# Altium schematic sheet B1029_T01_V1.1.SchDoc
size A2
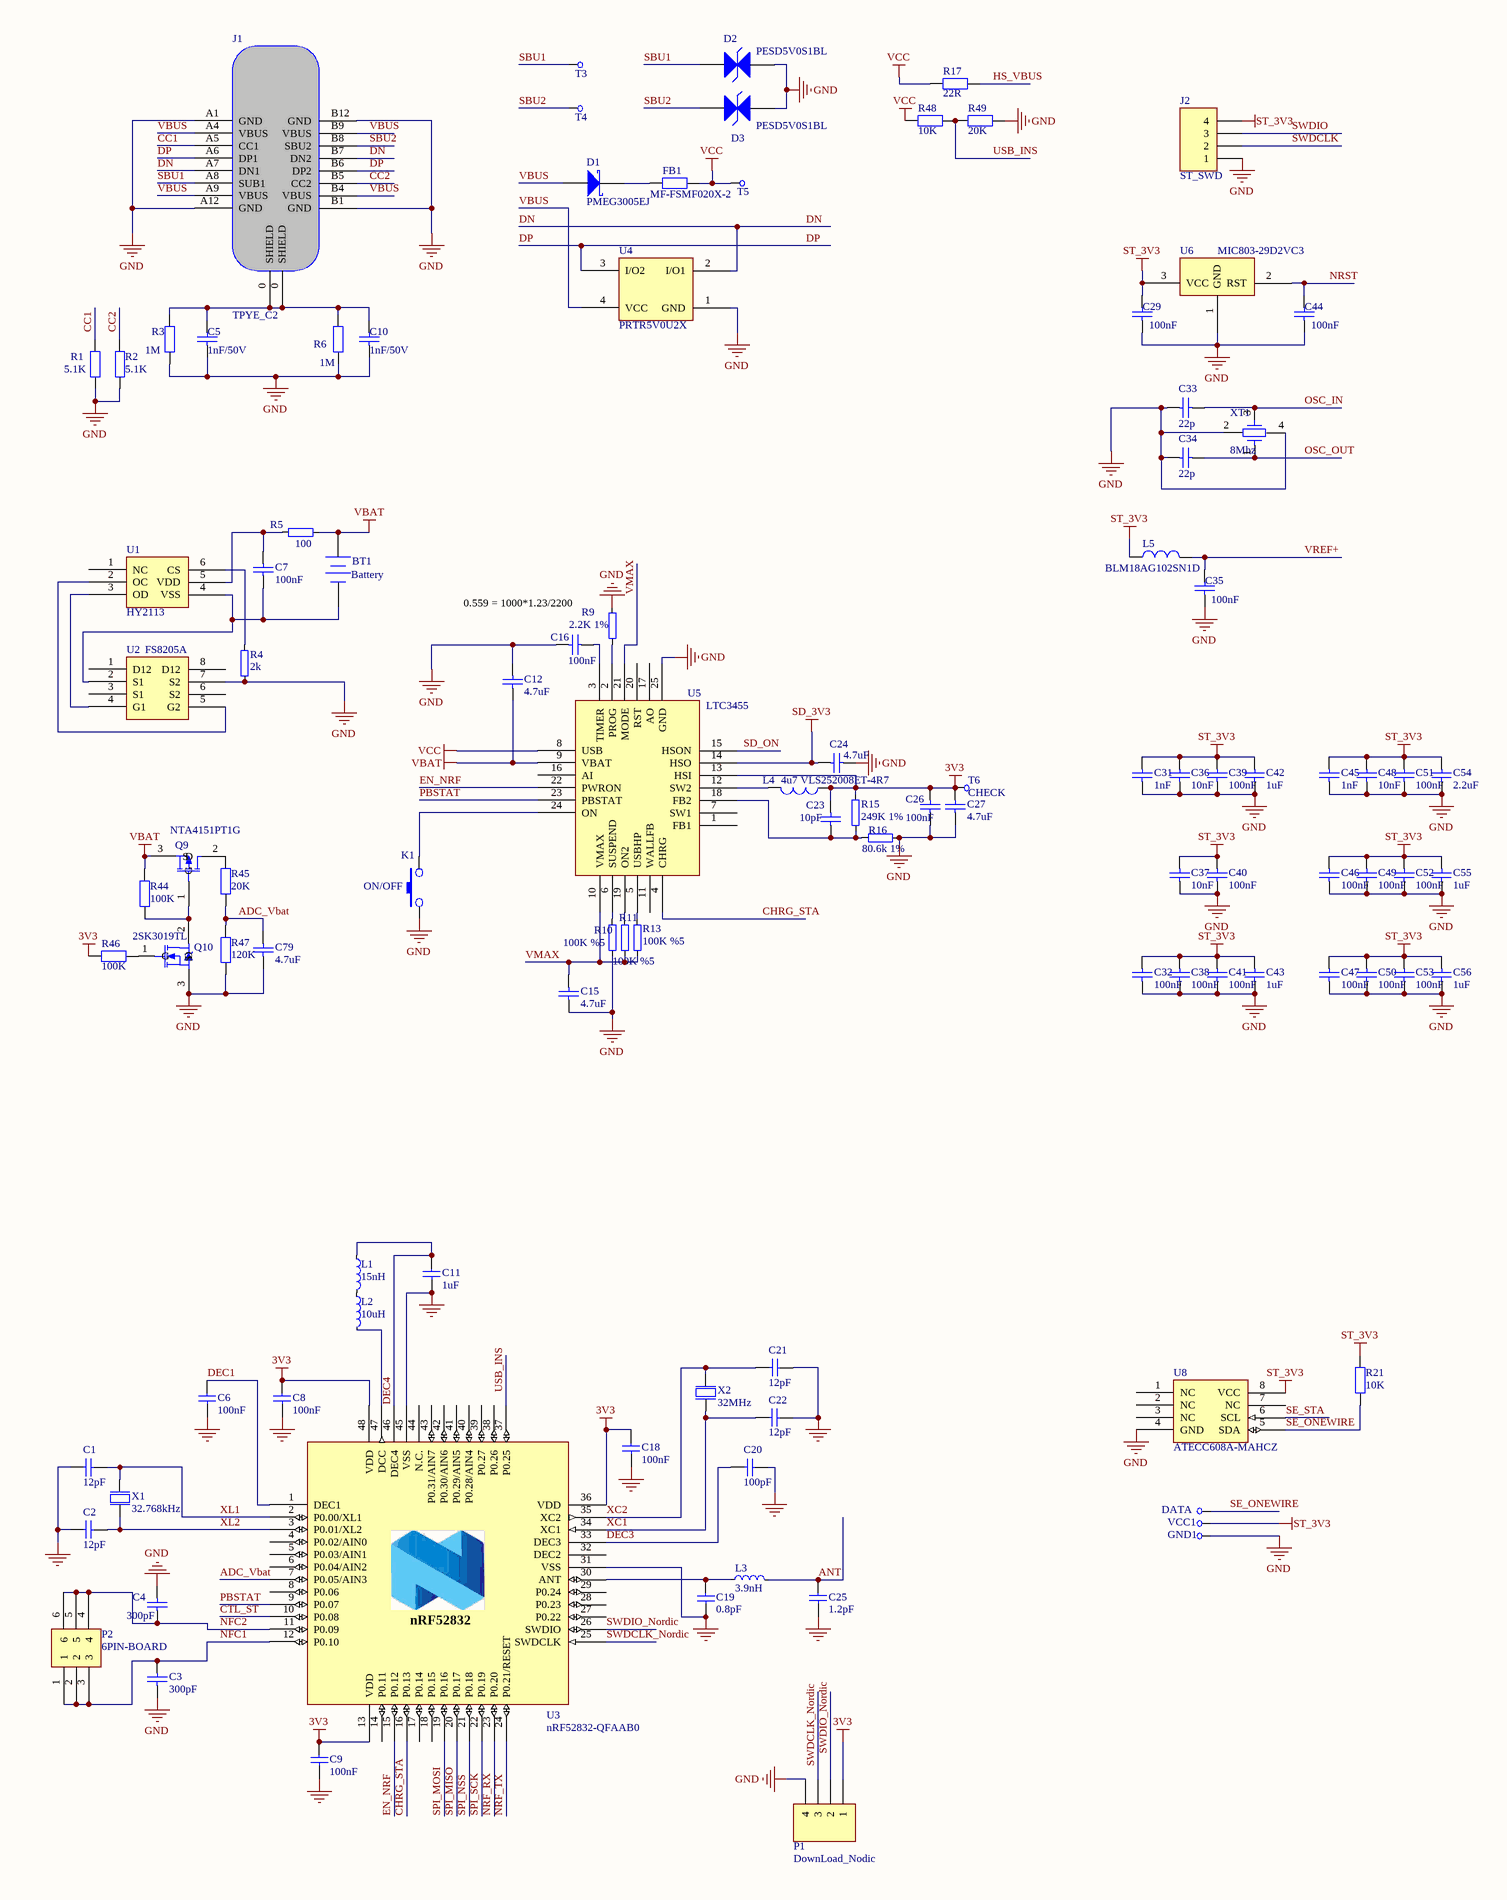
[diagram p0: B1029_T01_V1.1.SchDoc, left]
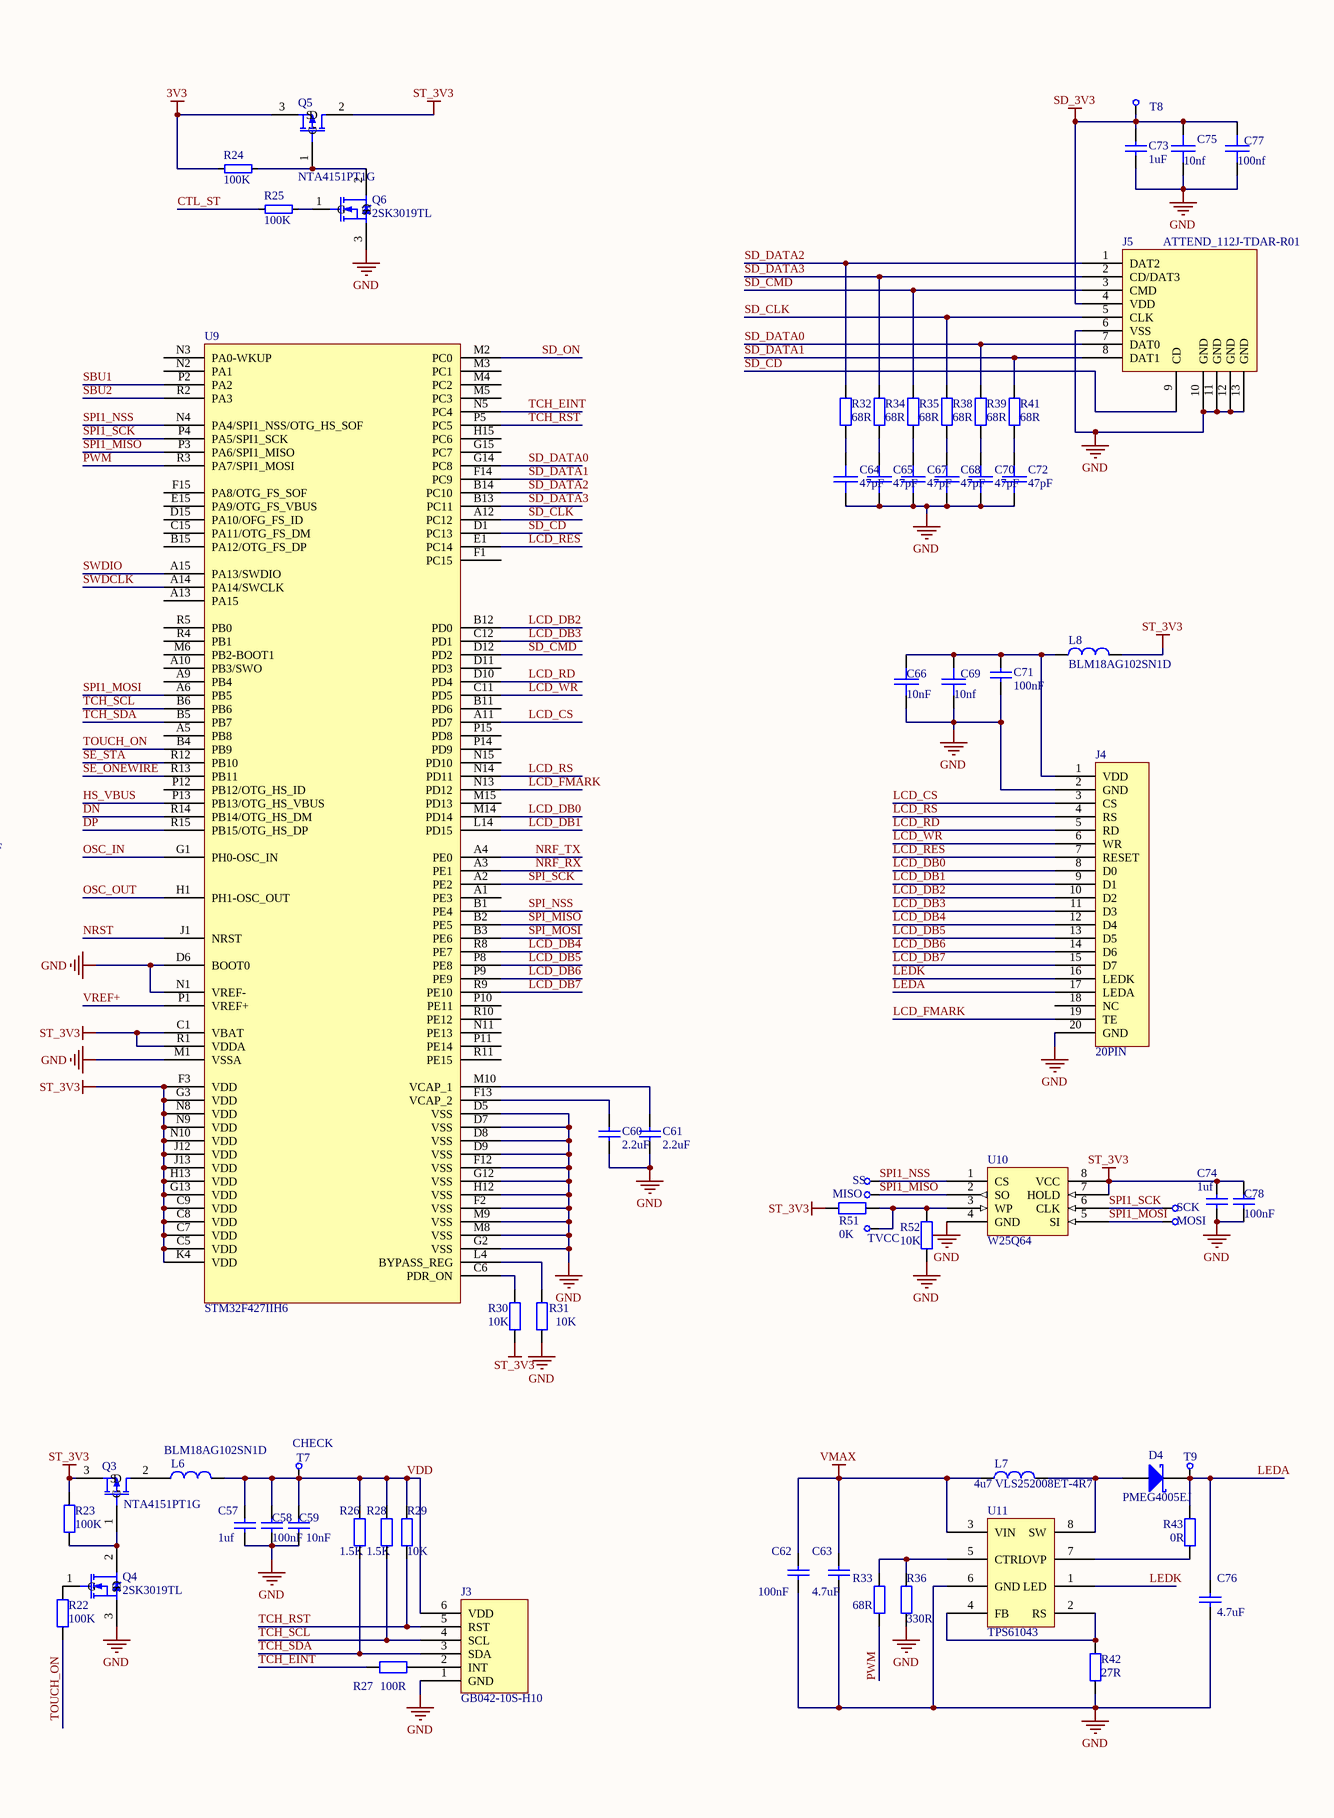
[diagram p1: B1029_T01_V1.1.SchDoc, right]

## Parts
BT1  Battery  [BAT_CON]
C1  12pF  [0402-c]
C2  12pF  [0402-c]
C3  300pF  [0402-C]
C4  300pF  [0402-C]
C5  1nF/50V  [0402-c]
C6  100nF  [0402-c]
C7  100nF  [0402-c]
C8  100nF  [0402-c]
C9  100nF  [0402-c]
C10  1nF/50V  [0402-c]
C11  1uF  [0402-c]
C12  4.7uF  [0402-c]
C15  4.7uF  [0402-c]
C16  100nF  [0402-c]
C18  100nF  [0402-c]
C19  0.8pF  [0402-c]
C20  100pF  [0402-c]
C21  12pF  [0402-c]
C22  12pF  [0402-c]
C23  10pF  [0402-c]
C24  4.7uF  [0402-c]
C25  1.2pF  [0402-c]
C26  100nF  [0402-C]
C27  4.7uF  [0402-c]
C29  100nF  [0402-c]
C31  1nF  [0402-c]
C32  100nF  [0402-c]
C33  value 22p  [0402-c]  (hidden comment: 20p)
C34  value 22p  [0402-C]  (hidden comment: 20p)
C35  100nF  [0402-c]
C36  10nF  [0402-c]
C37  10nF  [0402-c]
C38  100nF  [0402-c]
C39  100nF  [0402-c]
C40  100nF  [0402-c]
C41  100nF  [0402-c]
C42  1uF  [0402-c]
C43  1uF  [0402-c]
C44  100nF  [0402-c]
C45  1nF  [0402-c]
C46  100nF  [0402-c]
C47  100nF  [0402-c]
C48  10nF  [0402-c]
C49  100nF  [0402-c]
C50  100nF  [0402-c]
C51  100nF  [0402-c]
C52  100nF  [0402-c]
C53  100nF  [0402-c]
C54  2.2uF  [0402-c]
C55  1uF  [0402-c]
C56  1uF  [0402-c]
C57  1uf  [0402-c]
C58  100nF  [0402-c]
C59  10nF  [0402-c]
C60  2.2uF  [0402-c]
C61  2.2uF  [0402-c]
C62  100nF  [0402-c]
C63  4.7uF  [0402-c]
C64  47pF  [0402-c]
C65  47pF  [0402-c]
C66  10nF  [0402-C]
C67  47pF  [0402-C]
C68  47pF  [0402-c]
C69  10nf  [0402-c]
C70  47pF  [0402-C]
C71  100nF  [0402-c]
C72  47pF  [0402-C]
C73  1uF  [0402-c]
C74  1uf  [0402-c]
C75  10nf  [0402-c]
C76  4.7uF  [0402-c]
C77  100nf  [0402-c]
C78  100nF  [0402-c]
C79  4.7uF  [0402-c]
D1  PMEG3005EJ  [SOD323]
D2  PESD5V0S1BL  [SOD882]
D3  PESD5V0S1BL  [SOD882]
D4  PMEG4005EJ  [SOD323]
DATA  CHECK  [TEST_P]  (value not drawn)
FB1  MF-FSMF020X-2  [0603-1]
GND1  CHECK  [TEST_P]  (value not drawn)
J1  TPYE_C2  [TYPEC2]
J2  ST_SWD  [SWD_CON]
J3  GB042-10S-H10  [6PIN-1]
J4  20PIN  [20PIN-2]
J5  ATTEND_112J-TDAR-R01  [TF_1]
K1  ON/OFF  [switch_con1]
L1  15nH  [INDC1005X04L]
L2  10uH  [0603-1]
L3  3.9nH  [INDC1005X04L]
L4  4u7 VLS252008ET-4R7  [L_2.5X2.0]
L5  BLM18AG102SN1D  [0603-1]
L6  BLM18AG102SN1D  [0603-1]
L7  4u7 VLS252008ET-4R7  [L_2.5X2.0]
L8  BLM18AG102SN1D  [0603-1]
MISO  CHECK  [TEST_P]  (value not drawn)
MOSI  CHECK  [TEST_P]  (value not drawn)
P1  DownLoad_Nodic  [SWD_CON]
P2  6PIN-BOARD  [6PIN-DB]
Q3  NTA4151PT1G  [SOT523_MOSFET]
Q4  2SK3019TL  [SOT523_MOSFET]
Q5  NTA4151PT1G  [SOT523_MOSFET]
Q6  2SK3019TL  [SOT523_MOSFET]
Q9  NTA4151PT1G  [SOT523_MOSFET]
Q10  2SK3019TL  [SOT523_MOSFET]
R1  5.1K  [0402-a]
R2  5.1K  [0402-a]
R3  1M  [0402-a]
R4  2k  [0402-A]
R5  100  [0402-A]
R6  1M  [0402-a]
R9  2.2K 1%  [0402-A]
R10  100K %5  [0402-A]
R11  100K %5  [0402-A]
R13  100K %5  [0402-A]
R15  249K 1%  [0402-A]
R16  80.6k 1%  [0402-A]
R17  22R  [0402-a]
R21  10K  [0402-A]
R22  100K  [0402-A]
R23  100K  [0402-A]
R24  100K  [0402-A]
R25  100K  [0402-A]
R26  1.5K  [0402-A]
R27  100R  [0402-A]
R28  1.5K  [0402-A]
R29  10K  [0402-A]
R30  10K  [0402-A]
R31  10K  [0402-A]
R32  68R  [0402-A]
R33  68R  [0402-a]
R34  68R  [0402-A]
R35  68R  [0402-A]
R36  330R  [0402-a]
R38  68R  [0402-A]
R39  68R  [0402-A]
R41  68R  [0402-A]
R42  27R  [0402-a]
R43  0R  [0402-a]
R44  100K  [0402-A]
R45  20K  [0402-A]
R46  100K  [0402-A]
R47  120K  [0402-A]
R48  10K  [0402-A]
R49  20K  [0402-A]
R51  0K  [0402-A]
R52  10K  [0402-A]
SCK  CHECK  [TEST_P]  (value not drawn)
SS  CHECK  [TEST_P]  (value not drawn)
T3  CHECK  [TEST_P]  (value not drawn)
T4  CHECK  [TEST_P]  (value not drawn)
T5  CHECK  [TEST_P]  (value not drawn)
T6  CHECK  [TEST_P]
T7  CHECK  [TEST_P]
T8  CHECK  [TEST_P]  (value not drawn)
T9  CHECK  [TEST_P]  (value not drawn)
TVCC  CHECK  [TEST_P]  (value not drawn)
U1  HY2113  [DFN-6L]
U2  FS8205A  [TSSOP-8]
U3  nRF52832-QFAAB0  [2-QFN40P600X600X90-48N]
U4  PRTR5V0U2X  [SOT143B]
U5  LTC3455  [QFN-24]
U6  MIC803-29D2VC3  [SC70-3]
U8  ATECC608A-MAHCZ  [DFN8-SE]
U9  STM32F427IIH6  [UFBGA176+25]
U10  W25Q64  [WSON-8]
U11  TPS61043  [QFN-8]
VCC1  CHECK  [TEST_P]  (value not drawn)
X1  32.768kHz  [XTAL_3215]
X2  32MHz  [BT-XTAL_2016]
XT1  8Mhz  [OSC_4-3225]

## Nets
3V3: C8.2 C9.2 C18.2 C23.1 C26.2 C27.1 L4.1 P1.1 Q5.3(S) R15.1 R24.2 R46.2 T6.1 U3.13(VDD) U3.36(VDD) U3.48(VDD) U5.13(HSI)
GND: C1.1 C2.1 C3.1 C4.1 C5.1 C6.1 C8.1 C9.1 C10.1 C11.1 C12.2 C15.1 C16.1 C18.1 C19.2 C20.1 C21.1 C22.2 C24.1 C25.1 C26.1 C27.2 C29.1 C31.2 C32.2 C33.2 C34.2 C35.1 C36.2 C37.2 C38.2 C39.2 C40.2 C41.2 C42.2 C43.2 C44.1 C45.2 C46.2 C47.2 C48.2 C49.2 C50.2 C51.2 C52.2 C53.2 C54.2 C55.2 C56.2 C57.1 C58.1 C59.1 C60.2 C61.2 C62.1 C63.1 C64.1 C65.1 C66.2 C67.1 C68.1 C69.2 C70.1 C71.2 C72.1 C73.2 C74.1 C75.2 C76.1 C77.2 C78.1 C79.2 D2.1(A) D3.1(A) GND1.1 J1.A1(GND) J1.A12(GND) J1.B1(GND) J1.B12(GND) J2.1 J3.1(GND) J3.7 J3.8 J4.2(GND) J4.20(GND) J4.21 J4.22 J5.6(VSS) J5.10(GND) J5.11(GND) J5.12(GND) J5.13(GND) K1.1 P1.4 P2.0 Q4.3(S) Q6.3(S) Q10.3(S) R1.1 R2.1 R3.1 R4.2 R6.1 R9.1 R10.1 R16.1 R31.1 R36.1 R42.1 R47.1 R49.1 R52.1 U2.7(S2) U3.31(VSS) U3.45(VSS) U3.49(GND) U4.1(GND) U5.25(GND) U6.1(GND) U8.4(GND) U8.9(GND) U9.D5(VSS) U9.D6(BOOT0) U9.D7(VSS) U9.D8(VSS) U9.D9(VSS) U9.F2(VSS) U9.F6(GND) U9.F7(GND) U9.F8(GND) U9.F9(GND) U9.F10(GND) U9.F12(VSS) U9.G2(VSS) U9.G6(GND) U9.G7(GND) U9.G8(GND) U9.G9(GND) U9.G10(GND) U9.G12(VSS) U9.H6(GND) U9.H7(GND) U9.H8(GND) U9.H9(GND) U9.H10(GND) U9.H12(VSS) U9.J6(GND) U9.J7(GND) U9.J8(GND) U9.J9(GND) U9.J10(GND) U9.K6(GND) U9.K7(GND) U9.K8(GND) U9.K9(GND) U9.K10(GND) U9.M1(VSSA) U9.M8(VSS) U9.M9(VSS) U9.N1(VREF-) U10.4(GND) U10.9(GND) U11.6(GND) U11.9(GND) X2.2(GND) X2.4(GND) XT1.2 XT1.4
SD_3V3: C24.2 C73.1 C75.1 C77.1 J5.4(VDD) T8.1 U5.14(HSO)
ST_3V3: C29.2 C31.1 C32.1 C36.1 C37.1 C38.1 C39.1 C40.1 C41.1 C42.1 C43.1 C45.1 C46.1 C47.1 C48.1 C49.1 C50.1 C51.1 C52.1 C53.1 C54.1 C55.1 C56.1 C74.2 C78.2 J2.4 L5.1 L8.2 Q3.3(S) Q5.2(D) R21.1 R23.2 R30.1 R51.2 U6.3(VCC) U8.8(VCC) U9.C1(VBAT) U9.C5(VDD) U9.C7(VDD) U9.C8(VDD) U9.C9(VDD) U9.F3(VDD) U9.G3(VDD) U9.G13(VDD) U9.H13(VDD) U9.J12(VDD) U9.J13(VDD) U9.K4(VDD) U9.N8(VDD) U9.N9(VDD) U9.N10(VDD) U9.R1(VDDA) U10.7(HOLD) U10.8(VCC) VCC1.1
VBAT: BT1.1(+) C12.1 Q9.3(S) R5.2 R44.2 U5.9(VBAT)
VCC: FB1.2 R17.1 R48.1 T5.1 U5.8(USB)
VMAX: C15.2 C62.2 C63.2 L7.1 R11.2 R13.1 U5.10(VMAX) U5.21(MODE) U11.3(VIN)
ADC_Vbat: C79.1 R45.1 R47.2 U3.7(P0.05/AIN3)
ANT: C25.2 L3.2
CC1: J1.A5(CC1) R1.2
CC2: J1.B5(CC2) R2.2
CHRG_STA: U3.16(P0.13) U5.4(CHRG)
CTL_ST: R25.2 U3.10(P0.08)
DEC1: C6.2 U3.1(DEC1)
DEC3: C20.2 U3.33(DEC3)
DEC4: C11.2 L1.1 U3.46(DEC4)
DN: J1.A7(DN1) J1.B7(DN2) U4.2(I/O1) U9.R14(PB14/OTG_HS_DM)
DP: J1.A6(DP1) J1.B6(DP2) U4.3(I/O2) U9.R15(PB15/OTG_HS_DP)
EN_NRF: U3.15(P0.12) U5.22(PWRON)
HS_VBUS: R17.2 U9.P13(PB13/OTG_HS_VBUS)
LCD_CS: J4.3(CS) U9.A11(PD7)
LCD_DB0: J4.8(D0) U9.M14(PD14)
LCD_DB1: J4.9(D1) U9.L14(PD15)
LCD_DB2: J4.10(D2) U9.B12(PD0)
LCD_DB3: J4.11(D3) U9.C12(PD1)
LCD_DB4: J4.12(D4) U9.R8(PE7)
LCD_DB5: J4.13(D5) U9.P8(PE8)
LCD_DB6: J4.14(D6) U9.P9(PE9)
LCD_DB7: J4.15(D7) U9.R9(PE10)
LCD_FMARK: J4.19(TE) U9.N13(PD12)
LCD_RD: J4.5(RD) U9.D10(PD4)
LCD_RES: J4.7(RESET) U9.E1(PC14)
LCD_RS: J4.4(RS) U9.N14(PD11)
LCD_WR: J4.6(WR) U9.C11(PD5)
LEDA: C76.2 D4.2(K) J4.17(LEDA) R43.2 T9.1
LEDK: J4.16(LEDK) U11.1(LED)
NFC1: C3.2 P2.1 P2.2 P2.3 U3.12(P0.10)
NFC2: C4.2 P2.4 P2.5 P2.6 U3.11(P0.09)
NRF_RX: U3.23(P0.20) U9.A3(PE1)
NRF_TX: U3.24(P0.21/RESET) U9.A4(PE0)
NRST: C44.2 U6.2(RST) U9.J1(NRST)
OSC_IN: C33.1 U9.G1(PH0-OSC_IN) XT1.3
OSC_OUT: C34.1 U9.H1(PH1-OSC_OUT) XT1.1
PBSTAT: U3.9(P0.07) U5.23(PBSTAT)
PWM: R33.1 U9.R3(PA7/SPI1_MOSI)
SBU1: D2.2(K) J1.A8(SUB1) T3.1 U9.P2(PA2)
SBU2: D3.2(K) J1.B8(SBU2) T4.1 U9.R2(PA3)
SD_CD: J5.9(CD) U9.D1(PC13)
SD_CLK: J5.5(CLK) R38.1 U9.A12(PC12)
SD_CMD: J5.3(CMD) R35.1 U9.D12(PD2)
SD_DATA0: J5.7(DAT0) R39.1 U9.G14(PC8)
SD_DATA1: J5.8(DAT1) R41.1 U9.F14(PC9)
SD_DATA2: J5.1(DAT2) R32.1 U9.B14(PC10)
SD_DATA3: J5.2(CD/DAT3) R34.1 U9.B13(PC11)
SD_ON: U5.15(HSON) U9.M2(PC0)
SE_ONEWIRE: DATA.1 R21.2 U8.5(SDA) U9.R13(PB11)
SE_STA: U8.6(SCL) U9.R12(PB10)
SPI1_MISO: MISO.1 U9.P3(PA6/SPI1_MISO) U10.2(SO)
SPI1_MOSI: MOSI.1 U9.A6(PB5) U10.5(SI)
SPI1_NSS: SS.1 U9.N4(PA4/SPI1_NSS/OTG_HS_SOF) U10.1(CS)
SPI1_SCK: SCK.1 U9.P4(PA5/SPI1_SCK) U10.6(CLK)
SPI_MISO: U3.20(P0.17) U9.B2(PE5)
SPI_MOSI: U3.19(P0.16) U9.B3(PE6)
SPI_NSS: U3.21(P0.18) U9.B1(PE4)
SPI_SCK: U3.22(P0.19) U9.A2(PE2)
SWDCLK: J2.2 U9.A14(PA14/SWCLK)
SWDCLK_Nordic: P1.3 U3.25(SWDCLK)
SWDIO: J2.3 U9.A15(PA13/SWDIO)
SWDIO_Nordic: P1.2 U3.26(SWDIO)
TCH_EINT: R27.2 U9.N5(PC4)
TCH_RST: J3.5(RST) R29.1 U9.P5(PC5)
TCH_SCL: J3.4(SCL) R28.1 U9.B6(PB6)
TCH_SDA: J3.3(SDA) R26.1 U9.B5(PB7)
TOUCH_ON: R22.1 U9.B4(PB9)
USB_INS: R48.2 R49.2 U3.37(P0.25)
VBUS: D1.1(A) J1.A4(VBUS) J1.A9(VBUS) J1.B4(VBUS) J1.B9(VBUS) U4.4(VCC)
VDD: C57.2 C58.2 C59.2 J3.6(VDD) L6.2 R26.2 R28.2 R29.2 T7.1
VREF+: C35.2 L5.2 U9.P1(VREF+)
XC1: C22.1 U3.34(XC1) X2.1(inp)
XC2: C21.2 U3.35(XC2) X2.3(out)
XL1: C1.2 U3.2(P0.00/XL1) X1.1(inp)
XL2: C2.2 U3.3(P0.01/XL2) X1.2(out)
NetBT1_2: BT1.2(-) C7.1 U1.4(VSS) U2.2(S1)
NetC5_2: C5.2 C10.2 J1.0(SHIELD) R3.2 R6.2
NetC7_2: C7.2 R5.1 U1.5(VDD)
NetC16_2: C16.2 U5.3(TIMER)
NetC19_1: C19.1 L3.1 U3.30(ANT)
NetC23_2: C23.2 R15.2 R16.2 U5.18(FB2)
NetC60_1: C60.1 U9.F13(VCAP_2)
NetC61_1: C61.1 U9.M10(VCAP_1)
NetC64_2: C64.2 R32.2
NetC65_2: C65.2 R34.2
NetC66_1: C66.1 C69.1 C71.1 J4.1(VDD) L8.1
NetC67_2: C67.2 R35.2
NetC68_2: C68.2 R38.2
NetC70_2: C70.2 R39.2
NetC72_2: C72.2 R41.2
NetD1_2: D1.2(K) FB1.1
NetD4_1: D4.1(A) L7.2 U11.8(SW)
NetJ3_2: J3.2(INT) R27.1
NetK1_2: K1.2 U5.24(ON)
NetL1_2: L1.2 L2.1
NetL2_2: L2.2 U3.47(DCC)
NetL4_2: L4.2 U5.12(SW2)
NetL6_1: L6.1 Q3.2(D)
NetQ3_1: Q3.1(G) Q4.2(D) R23.1
NetQ4_1: Q4.1(G) R22.2
NetQ5_1: Q5.1(G) Q6.2(D) R24.1
NetQ6_1: Q6.1(G) R25.1
NetQ9_1: Q9.1(G) Q10.2(D) R44.1
NetQ9_2: Q9.2(D) R45.2
NetQ10_1: Q10.1(G) R46.1
NetR4_1: R4.1 U1.6(CS)
NetR9_2: R9.2 U5.2(PROG)
NetR10_2: R10.2 U5.6(SUSPEND)
NetR11_1: R11.1 U5.19(ON2)
NetR13_2: R13.2 U5.5(USBHP)
NetR30_2: R30.2 U9.C6(PDR_ON)
NetR31_2: R31.2 U9.L4(BYPASS_REG)
NetR33_2: R33.2 R36.2 U11.5(CTRL)
NetR42_2: R42.2 U11.2(RS) U11.4(FB)
NetR43_1: R43.1 U11.7(OVP)
NetR51_1: R51.1 R52.2 TVCC.1 U10.3(WP)
NetU1_2: U1.2(OC) U2.5(G2)
NetU1_3: U1.3(OD) U2.4(G1)

Not connected (* = marked no-connect by the designer): J4 18(NC); U1 1(NC); U2 1(D12) 3(S1) 6(S2) 8(D12); U3 4(P0.02/AIN0) 5(P0.03/AIN1) 6(P0.04/AIN2) 8(P0.06) 14(P0.11) 17(P0.14) 18(P0.15) 27(P0.22) 28(P0.23) 29(P0.24) 32(DEC2) 38(P0.26) 39(P0.27) 40(P0.28/AIN4) 41(P0.29/AIN5) 42(P0.30/AIN6) 43(P0.31/AIN7) 44(N.C.); U5 1(FB1) 7(SW1) 11(WALLFB) 16(AI) 17(AO) 20(RST); U8 1(NC) 2(NC) 3(NC) 7(NC); U9 A1(PE3) A5(PB8) A7(PG14) A8(PG13) A9(PB4) A10(PB3/SWO) A13(PA15) B7(PG15) B8(PG12) B9(PG11) B10(PG10) B11(PD6) B15(PA12/OTG_FS_DP) C2(PI7) C3(PI6) C4(PI5) C10(PG9) C13(PI3) C14(PI2) C15(PA11/OTG_FS_DM) D2(PI8) D3(PI9) D4(PI4) D11(PD3) D13(PH15) D14(PI1) D15(PA10/OFG_FS_ID) E2(PF0) E3(PI10) E4(PI11) E12(PH13) E13(PH14) E14(PI0) E15(PA9/OTG_FS_VBUS) F1(PC15) F4(PH2) F15(PA8/OTG_FS_SOF) G4(PH3) G15(PC7) H2(PF2) H3(PF1) H4(PH4) H14(PG8) H15(PC6) J2(PF3) J3(PF4) J4(PH5) J14(PG7) J15(PG6) K1(PF7) K2(PF6) K3(PF5) K12(PH12) K13(PG5) K14(PG4) K15(PG3) L1(PF10) L2(PF9) L3(PF8) L12(PH11) L13(PH10) L15(PG2) M3(PC1) M4(PC2) M5(PC3) M6(PB2-BOOT1) M7(PG1) M11(PH6) M12(PH8) M13(PH9) M15(PD13) N2(PA1) N3(PA0-WKUP) N6(PF13) N7(PG0) N11(PE13) N12(PH7) N15(PD10) P6(PF12) P7(PF15) P10(PE11) P11(PE14) P12(PB12/OTG_HS_ID) P14(PD9) P15(PD8) R4(PB1) R5(PB0) R6(PF11) R7(PF14) R10(PE12) R11(PE15)

## Notes on the sheet
- 0.559 = 1000*1.23/2200
- (in symbol nRF52832-QFAAB0) nRF52832

## Library data of the parts
BT1 = Battery: 备份电池; Published: 24-Mar-1999; LatestRevisionDate: 17-Jul-2002; LatestRevisionNote: Re-released for DXP Platform.; PackageReference: BAT-2; Publisher: Altium Limited
C1 C2 C21 C22 = C0402-12p: Capacitor, NP0, ?%; Part number IPS: 00000002398; Note: 50V; Artikkelnr Noca: 20029159; Artikkelnr Simpro: N.A.; Part Number: C0402-12p; Manufacturer: *; Manufacturer Part Number: *; Datasheet: *; LatestRevisionDate: 2011-05-11; Pin Count: 2; Publisher: Nordic Semiconductor; Published: 2009-05-08; Value: 12pF; Supplier: *; Supplier part number: *; 2nd source Supplier: *; 2nd source part number: *; Footprint Doc: 0402
C3 C4 = Cap: Capacitor; Published: 8-Jun-2000; LatestRevisionDate: 17-Jul-2002; LatestRevisionNote: Re-released for DXP Platform.; PackageReference: RAD-0.3; Publisher: Altium Limited; Value: 300pF
C5 C7 C10 C12 C15 C16 C23 C24 C27 C29 C31-C63 C71 C73 C74 C76 C78 C79 = Cap: 无极性电容; Published: 8-Jun-2000; LatestRevisionDate: 17-Jul-2002; LatestRevisionNote: Re-released for DXP Platform.; PackageReference: RAD-0.3; Publisher: Altium Limited
  C5 C10: Value: 1nF/50V
  C7 C16 C29 C32 C35 C38-C41 C44 C46 C47 C49-C53 C58 C62 C71 C78: Value: 100nF
  C12 C15 C24 C27 C63 C76 C79: Value: 4.7uF
  C23: Value: 10pF
  C31 C45: Value: 1nF
  C36 C37 C48 C59: Value: 10nF
  C42 C43 C55 C56 C73: Value: 1uF
  C54 C60 C61: Value: 2.2uF
  C57 C74: Value: 1uf
C6 C9 C18 = C0402-100n: Capacitor, X7R, ?0%; Part number IPS: 00000005296; Note: 16V; Artikkelnr Noca: 20039200; Artikkelnr Simpro: N.A.; Part Number: C0402-100n; Manufacturer: *; Manufacturer Part Number: *; Datasheet: *; LatestRevisionDate: 2009-11-23; Pin Count: 2; Publisher: Nordic Semiconductor; Published: 2009-05-08; Value: 100nF; Supplier: *; Supplier part number: *; 2nd source Supplier: *; 2nd source part number: *; Footprint Doc: 0402
C8 = C0603-4?: Capacitor, X5R, ?0%; Part number IPS: 00000003141; Note: 6.3V; Artikkelnr Noca: 20069060; Artikkelnr Simpro: N.A.; Part Number: C0603-4?; Manufacturer: *; Manufacturer Part Number: *; Datasheet: *; LatestRevisionDate: 2009-11-23; Pin Count: 2; Publisher: Nordic Semiconductor; Published: 2009-05-08; Value: 100nF; Supplier: *; Supplier part number: *; 2nd source Supplier: *; 2nd source part number: *; Footprint Doc: 0603
C11 = C0603-1?: Capacitor, X7R, ?0%; Part number IPS: 00000000616; Value: 1.0uF; Note: 16V; Artikkelnr Noca: 20039335; Artikkelnr Simpro: N.A.; Part Number: C0603-1?; Manufacturer: *; Manufacturer Part Number: *; Datasheet: *; LatestRevisionDate: 2013-06-05; Pin Count: 2; Publisher: Nordic Semiconductor; Published: 2009-05-08; Supplier: *; Supplier part number: *; 2nd source Supplier: *; 2nd source part number: *; Footprint Doc: 0603
C19 = C0402-0.8p: Capacitor, NP0, ?%; Note: 50V; Artikkelnr Noca: 20029147; Artikkelnr Simpro: N.A.; Part Number: C0402-0.8p; Manufacturer: *; Manufacturer Part Number: *; Datasheet: *; LatestRevisionDate: 2012-11-21; Pin Count: 2; Publisher: Nordic Semiconductor; Published: 2009-05-08; Value: 0.8pF; Supplier: *; Supplier part number: *; 2nd source Supplier: *; 2nd source part number: *; Footprint Doc: 0402
C20 = C0402-100p: Capacitor, NP0, ?%; Part number IPS: 00000002361; Note: 50V; Artikkelnr Noca: 20029135; Artikkelnr Simpro: N.A.; Part Number: C0402-100p; Manufacturer: *; Manufacturer Part Number: *; Datasheet: *; LatestRevisionDate: 2009-05-08; Pin Count: 2; Publisher: Nordic Semiconductor; Published: 2009-05-08; Value: 100pF; Supplier: *; Supplier part number: *; 2nd source Supplier: *; 2nd source part number: *; Footprint Doc: 0402
C25 = C0402-1.2p: Capacitor, NP0, ?.1pF; Part number IPS: 00000005410; Note: 50V; Artikkelnr Noca: 20029157; Artikkelnr Simpro: N.A.; Part Number: C0402-1.2p; Manufacturer: *; Manufacturer Part Number: *; Datasheet: *; LatestRevisionDate: 2011-05-11; Pin Count: 2; Publisher: Nordic Semiconductor; Published: 2009-05-08; Value: 1.2pF; Supplier: *; Supplier part number: *; 2nd source Supplier: *; 2nd source part number: *; Footprint Doc: 0402
C26 = Cap: 无极性电容; Value: 0.1uF; Published: 8-Jun-2000; LatestRevisionDate: 17-Jul-2002; LatestRevisionNote: Re-released for DXP Platform.; PackageReference: RAD-0.3; Publisher: Altium Limited
C64-C70 C72 C75 C77 = SMT_C_0402: Surface mount capacitor 0402
D1 D4 = D-Schottky: 肖特基二极管; Published: 8-Jun-2000; LatestRevisionDate: 17-Jul-2002; LatestRevisionNote: Re-released for DXP Platform.; PackageReference: SMB; Publisher: Altium Limited; Code_JEDEC: DO-214-AA
  D1: Type: PMEG3005EJ
  D4: Type: PMEG4005EJ
D2 D3 = TVS_DIOCODE: TVS
DATA GND1 MISO MOSI SCK SS T3-T9 TVCC VCC1 = CHECK: 测试点
FB1 R1-R3 R6 R17 R21-R23 R26-R36 R38 R39 R41-R49 R51 R52 = Res1: 贴片电阻; Published: 8-Jun-2000; LatestRevisionDate: 17-Jul-2002; LatestRevisionNote: Re-released for DXP Platform.; PackageReference: AXIAL-0.4; Publisher: Altium Limited
  FB1: Value: MF-FSMF020X-2
  R1 R2: Value: 5.1K
  R3 R6: Value: 1M
  R17: Value: 22R
  R21 R29-R31 R48 R52: Value: 10K
  R22 R23 R44 R46: Value: 100K
  R26 R28: Value: 1.5K
  R27: Value: 100R
  R32-R35 R38 R39 R41: Value: 68R
  R36: Value: 330R
  R42: Value: 27R
  R43: Value: 0R
  R45 R49: Value: 20K
  R47: Value: 120K
  R51: Value: 0K
J1 = TPYE_C2: USB
J2 P1 = Header 4: Header, 4-Pin; LatestRevisionDate: 17-Jul-2002; LatestRevisionNote: Re-released for DXP Platform.; Publisher: Altium Limited
J3 = GB042-10S--H10: Touch
J5 = ATTEND_112J-TDAR-R01: MICRO_SD
K1 = KEY
L1 = L0402-15n: Inductor, 320mA, ?%; Manufacturer: Taiyo Yuden; Manufacturer Part Number: HK100515NJ-T; 2nd source part number: 658-1328; Note: High frequency chip inductor ?0%; Artikkelnr Noca: 33029323; Artikkelnr Simpro: N.A.; Part Number: L0402-15n; LatestRevisionDate: 2012-09-19; Pin Count: 2; Publisher: Nordic Semiconductor; Published: 2010-07-12; Value: 15nH; Supplier: Digi-Key; Datasheet: http://www.yuden.co.jp/productdata/catalog/en/mlci04_e.pdf; Supplier part number: 587-1521-1-ND; 2nd source Supplier: Farnell; Footprint Doc: 0402; ComponentLink1Description: Datasheet; ComponentLink2Description: Supplier link
L2 = L0603-10?: Inductor, 80mA, ?0%; Manufacturer: Taiyo Yuden; Manufacturer Part Number: LBMF1608T100K; 2nd source part number: 178-6105; Note: LBMF1608T100K 10µH 80mA 0603; Artikkelnr Noca: 33029314; Artikkelnr Simpro: N.A.; Part Number: L0603-10?; Datasheet: http://www.yuden.co.jp/ut/product/pdf/elb2_e.pdf; LatestRevisionDate: 2012-09-19; Pin Count: 2; Publisher: Nordic Semiconductor; Published: 2010-02-24; Value: 10uH; Supplier: Digi-Key; Supplier part number: 587-1714-1-ND; 2nd source Supplier: Farnell; Footprint Doc: 0603; ComponentLink1Description: Datasheet; ComponentLink2Description: Supplier link
L3 = L0402-3n9: Inductor, 170mA, ?.1nH; Manufacturer: Murata; Manufacturer Part Number: LQP15MN3N9B02D; Note: High frequency chip inductor ?%; Artikkelnr Noca: 33029151; Artikkelnr Simpro: N.A.; Part Number: L0402-3n9; Datasheet: http://search.murata.co.jp/Ceramy/image/img/PDF/ENG/L0075S0084LQP15M.pdf; LatestRevisionDate: 2012-09-19; Pin Count: 2; Publisher: Nordic Semiconductor; Published: 2009-05-08; Value: 3.9nH; Supplier: Digi-Key; Supplier part number: 490-1131-1-ND; 2nd source Supplier: *; 2nd source part number: *; Footprint Doc: 0402; ComponentLink1Description: Datasheet; ComponentLink2Description: Supplier link
L4-L8 = Inductor: 电感; Code_IEC: 1005; Published: 8-Jun-2000; LatestRevisionDate: 17-Jul-2002; LatestRevisionNote: Re-released for DXP Platform.; PackageReference: 0402-A; Publisher: Altium Limited; Code_JEITA: 0402
  L4 L7: Value: 4u7 VLS252008ET-4R7
  L5 L6 L8: Value: BLM18AG102SN1D
Q3 Q5 Q9 = MOSFET-P: P-Channel MOSFET; PackageDocument: 1995/1996; Published: 8-Jun-2000; LatestRevisionDate: 17-Jul-2002; LatestRevisionNote: Re-released for DXP Platform.; PackageReference: E3; Publisher: Altium Limited
Q4 Q6 Q10 = MOSFET-N: N-Channel MOSFET; PackageDocument: 1995/1996; Published: 8-Jun-2000; LatestRevisionDate: 17-Jul-2002; LatestRevisionNote: Re-released for DXP Platform.; PackageReference: E3; Publisher: Altium Limited
R4 R5 R9-R11 R13 R15 R16 R24 R25 = R-10K: resistor
U1 = HY2113: Charger
U2 = FS8205A: Charger IC
U3 = nRF52832-QFAAB0: Multi-protocol Bluetooth Low Energy, ANT and 2.4GHz proprietary system-on-chip; Manufacturer: Nordic Semiconductor; Artikkelnr Noca: 15079334; Artikkelnr Simpro: N.A.; Part Number: nRF52832-QFAAB0; Manufacturer Part Number: nRF52832-QFAAB0; Datasheet: *; LatestRevisionDate: 2016-08-25; Pin Count: 48; Publisher: Nordic Semiconductor; Published: 2016-08-25; Value: nRF52832-QFAAB0; Note: *; Supplier: Nordic Semiconductor; Supplier part number: nRF52832-QFAAB0; 2nd source Supplier: *; 2nd source part number: *; Footprint Doc: QFN-48
U4 = PRTR5V0U2X: ESD_Protect
U6 = MIC803
U8 = ATECC608A
U10 = SPI_FLASH
U11 = TPS61043: Led Drvier
X1 = XTAL_FC-135 32.768k: XTAL SMD 3215, 32.768kHz, 9pF, ?0ppm; Manufacturer: Epson Toyocom; Manufacturer Part Number: FC-135 32.768KHZ ?0PPM,9.0PF; 2nd source part number: 127-8037; Note: XTAL SMD 32.768kHz, 3215; Artikkelnr Noca: 22019091; Artikkelnr Simpro: N.A.; Part Number: XTAL_FC-135 32.768k; Datasheet: http://www.farnell.com/datasheets/57480.pdf; LatestRevisionDate: 2014-03-27; Pin Count: 2; Publisher: Nordic Semiconductor; Published: 2010-10-18; Value: 32.768kHz; Supplier: Digi-Key; Supplier part number: FC-135 32.7680KA-AC-ND; 2nd source Supplier: Farnell; Footprint Doc: XTAL_3215
X2 = XTAL_SMD2016_32MHz_8pF_Epson: XTAL SMD 2016, 32MHz, Cl=8pF, Tol: ?0ppm, Stab: ?0ppm; Manufacturer: Epson Toyocom; Manufacturer Part Number: Q22FA12800025; Note: XTAL SMD 32.000MHz; Artikkelnr Noca: 22019238; Artikkelnr Simpro: N.A.; Part Number: XTAL_SMD2016_32MHz_8pF_Epson; Datasheet: http://www.epsondevice.com/docs/qd/en/DownloadServlet?id=ID000449; LatestRevisionDate: 2014-11-27; Pin Count: 4; Publisher: Nordic Semiconductor; Published: 2012-03-09; Value: 32MHz; Supplier: Farnell; Supplier part number: 171-2806; 2nd source Supplier: *; 2nd source part number: *; Footprint Doc: XTAL_2016
XT1 = XT: 晶振